# EAGLE design LC-meter (EAGLE 7.5.0)
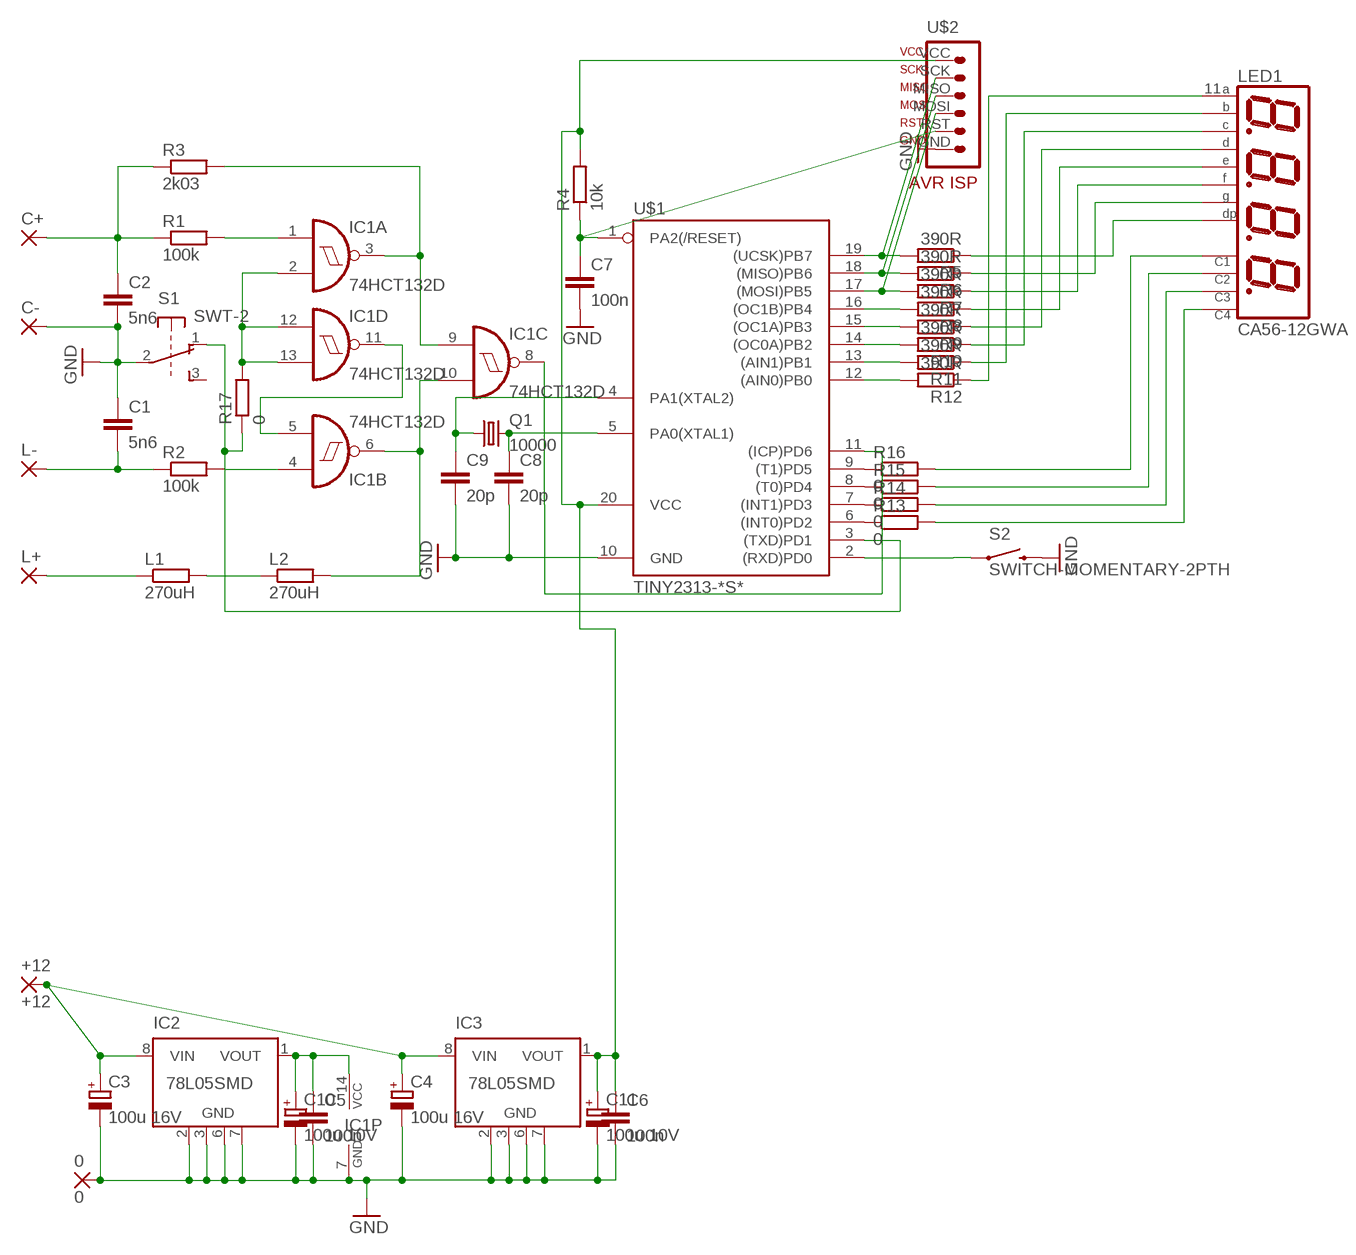
[diagram p0: schematic, sheet 1]

## Parts
0  0  3,17/1,1  [3,17/1,1]
+12  +12  3,17/1,1  [3,17/1,1]
C1  5n6  C-EUC0805  [C0805]
C2  5n6  C-EUC0805  [C0805]
C3  100u 16V  CPOL-EUE2.5-7  [E2,5-7]
C4  100u 16V  CPOL-EUE2.5-7  [E2,5-7]
C5  100n  C-EUC0805  [C0805]
C6  100n  C-EUC0805  [C0805]
C7  100n  C-EUC0805  [C0805]
C8  20p  C-EUC1206  [C1206]
C9  20p  C-EUC1206  [C1206]
C10  100u 10V  CPOL-EUE2.5-7  [E2,5-7]
C11  100u 10V  CPOL-EUE2.5-7  [E2,5-7]
C+  3,17/1,1  [3,17/1,1]
C-  3,17/1,1  [3,17/1,1]
IC1  74HCT132D  [SO14]
IC2  78L05SMD  [SO08]
IC3  78L05SMD  [SO08]
L1  270uH  R-EU_R1210  [R1210]
L2  270uH  R-EU_R1210  [R1210]
L+  3,17/1,1  [3,17/1,1]
L-  3,17/1,1  [3,17/1,1]
LED1  CA56-12GWA  [0,56_4X7SEG_LED]
Q1  10000  CRYSTALHC49S  [HC49/S]
R1  100k  R-EU_R1206  [R1206]
R2  100k  R-EU_R1206  [R1206]
R3  2k03  R-EU_R1206  [R1206]
R4  10k  R-EU_R1206  [R1206]
R5  390R  R-EU_R1206  [R1206]
R6  390R  R-EU_R1206  [R1206]
R7  390R  R-EU_R1206  [R1206]
R8  390R  R-EU_R1206  [R1206]
R9  390R  R-EU_R1206  [R1206]
R10  390R  R-EU_R1206  [R1206]
R11  390R  R-EU_R1206  [R1206]
R12  390R  R-EU_R1206  [R1206]
R13  0  R-EU_R1206  [R1206]
R14  0  R-EU_R1206  [R1206]
R15  0  R-EU_R1206  [R1206]
R16  0  R-EU_R1206  [R1206]
R17  0  R-EU_R1206  [R1206]
S1  SWT-2  [SWT-2]
S2  SWITCH-MOMENTARY-2PTH  [TACTILE-PTH]
U$1  TINY2313-*S*  [SO20L$]
U$2  AVR-ISP-6-ROW  [AVR-ISP-6-ROW]

## Nets
GND: 0.1(P) C1.1 C2.2 C3.- C4.- C5.2 C6.2 C7.2 C8.2 C9.2 C10.- C11.- C-.1(P) IC1.7(P:GND) IC2.2(GND) IC2.3(GND) IC2.6(GND) IC2.7(GND) IC3.2(GND) IC3.3(GND) IC3.6(GND) IC3.7(GND) S1.2 S2.3 U$1.10(GND) U$2.GND
N$1: IC1.8(C:O) U$1.11((ICP)PD6)
N$2: R17.1 S1.1 U$1.3((TXD)PD1)
N$3: IC1.5(B:I1) IC1.11(D:O)
N$4: IC1.6(B:O) IC1.10(C:I1) L2.2
N$5: IC1.3(A:O) IC1.9(C:I0) R3.2
N$6: IC1.1(A:I0) R1.2
N$7: IC1.4(B:I0) R2.2
N$8: C1.2 L-.1(P) R2.1
N$9: C2.1 C+.1(P) R1.1 R3.1
N$10: L1.1 L+.1(P)
N$11: L1.2 L2.1
N$12: +12.1(P) C3.+ C4.+ IC2.8(VIN) IC3.8(VIN)
N$13: R5.2 U$1.19((UCSK)PB7) U$2.SCK
N$14: R13.1 U$1.6((INT0)PD2)
N$15: C6.1 C11.+ IC3.1(VOUT) R4.2 U$1.20(VCC) U$2.VCC
N$16: C5.1 C10.+ IC1.14(P:VCC) IC2.1(VOUT)
N$17: R6.2 U$1.18((MISO)PB6) U$2.MISO
N$18: C7.1 R4.1 U$1.1(PA2(/RESET)) U$2.RST
N$19: C8.1 Q1.2 U$1.5(PA0(XTAL1))
N$20: C9.1 Q1.1 U$1.4(PA1(XTAL2))
N$21: S2.1 U$1.2((RXD)PD0)
N$22: R7.2 U$1.17((MOSI)PB5) U$2.MOSI
N$23: R8.2 U$1.16((OC1B)PB4)
N$24: R9.2 U$1.15((OC1A)PB3)
N$25: R10.2 U$1.14((OC0A)PB2)
N$26: R11.2 U$1.13((AIN1)PB1)
N$27: R12.2 U$1.12((AIN0)PB0)
N$28: LED1.11(A) R12.1
N$29: LED1.7(B) R11.1
N$30: LED1.4(C) R10.1
N$31: LED1.2(D) R9.1
N$32: LED1.1(E) R8.1
N$33: LED1.10(F) R7.1
N$34: LED1.5(G) R6.1
N$35: LED1.3(DP) R5.1
N$36: LED1.12(A1) R16.2
N$37: LED1.9(A2) R15.2
N$38: LED1.8(A3) R14.2
N$39: LED1.6(A4) R13.2
N$40: R14.1 U$1.7((INT1)PD3)
N$41: R15.1 U$1.8((T0)PD4)
N$42: R16.1 U$1.9((T1)PD5)
N$43: IC1.2(A:I1) IC1.12(D:I0) IC1.13(D:I1) R17.2
Unconnected: IC2.4(NC) IC2.5(NC) IC3.4(NC) IC3.5(NC) S1.3 S1.4 S1.5 S1.6

## Library data of the parts
0 +12 C+ C- L+ L- = wirepad:3,17/1,1: THROUGH-HOLE PAD
C1 C2 C5-C9 = rcl:C-EU: CAPACITOR, European symbol
C3 C4 C10 C11 = rcl:CPOL-EU: POLARIZED CAPACITOR, European symbol
IC1 = 74xx-eu:74*132: Quad 2-input NAND schmitt trigger
IC2 IC3 = linear:78L*SMD: Positive VOLTAGE REGULATOR
L1 L2 R1-R17 = rcl:R-EU_: RESISTOR, European symbol
LED1 = Namenlos:CA56-12GWA
Q1 = crystal:CRYSTAL: CRYSTAL; OC_FARNELL: 1667008; OC_NEWARK: unknown
S1 = Namenlos:SWT-2
S2 = SparkFun-Electromechanical:SWITCH-MOMENTARY-2: Various NO switches- pushbuttons, reed, etc; PROD_ID: SWCH-08441
U$1 = avr-7:TINY2313*: Atmel Tiny2313 2K Flash, 128 bytes EEPROM, 128 bytes RAM
U$2 = Namenlos:AVR-ISP-6-ROW

## Board
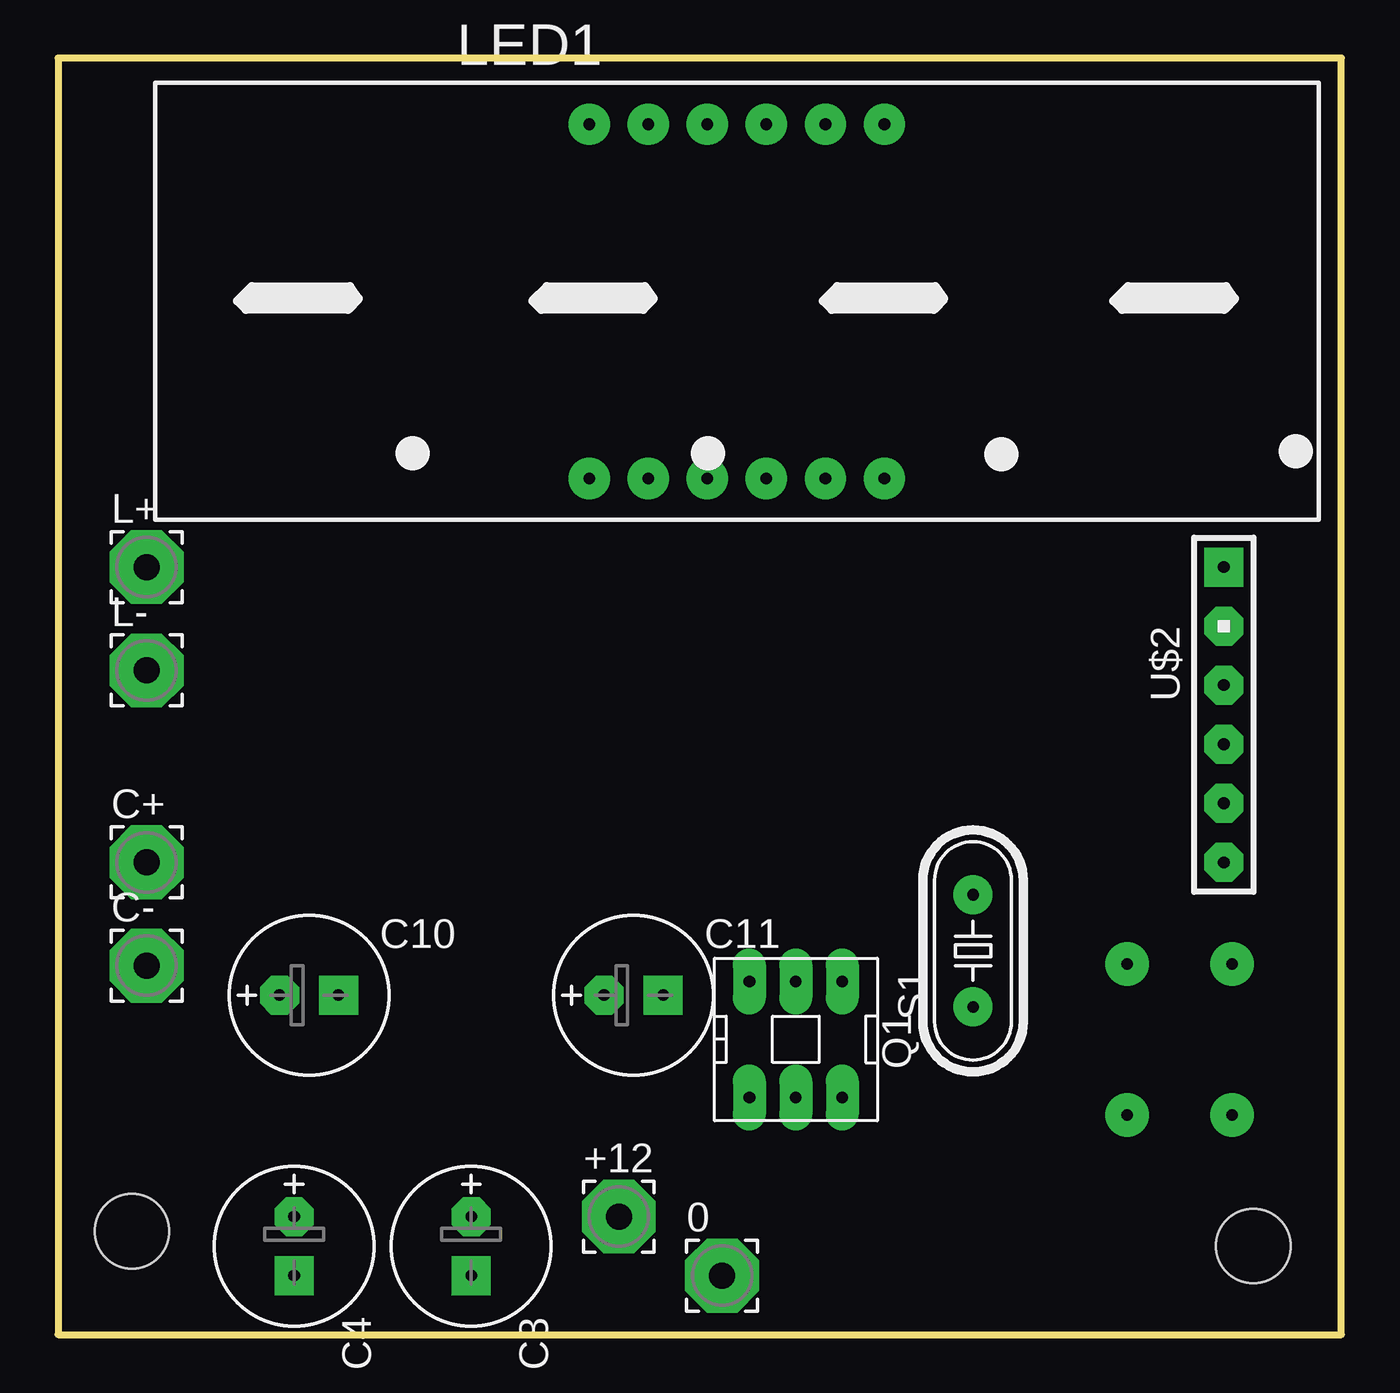
[diagram p1: board, top side]
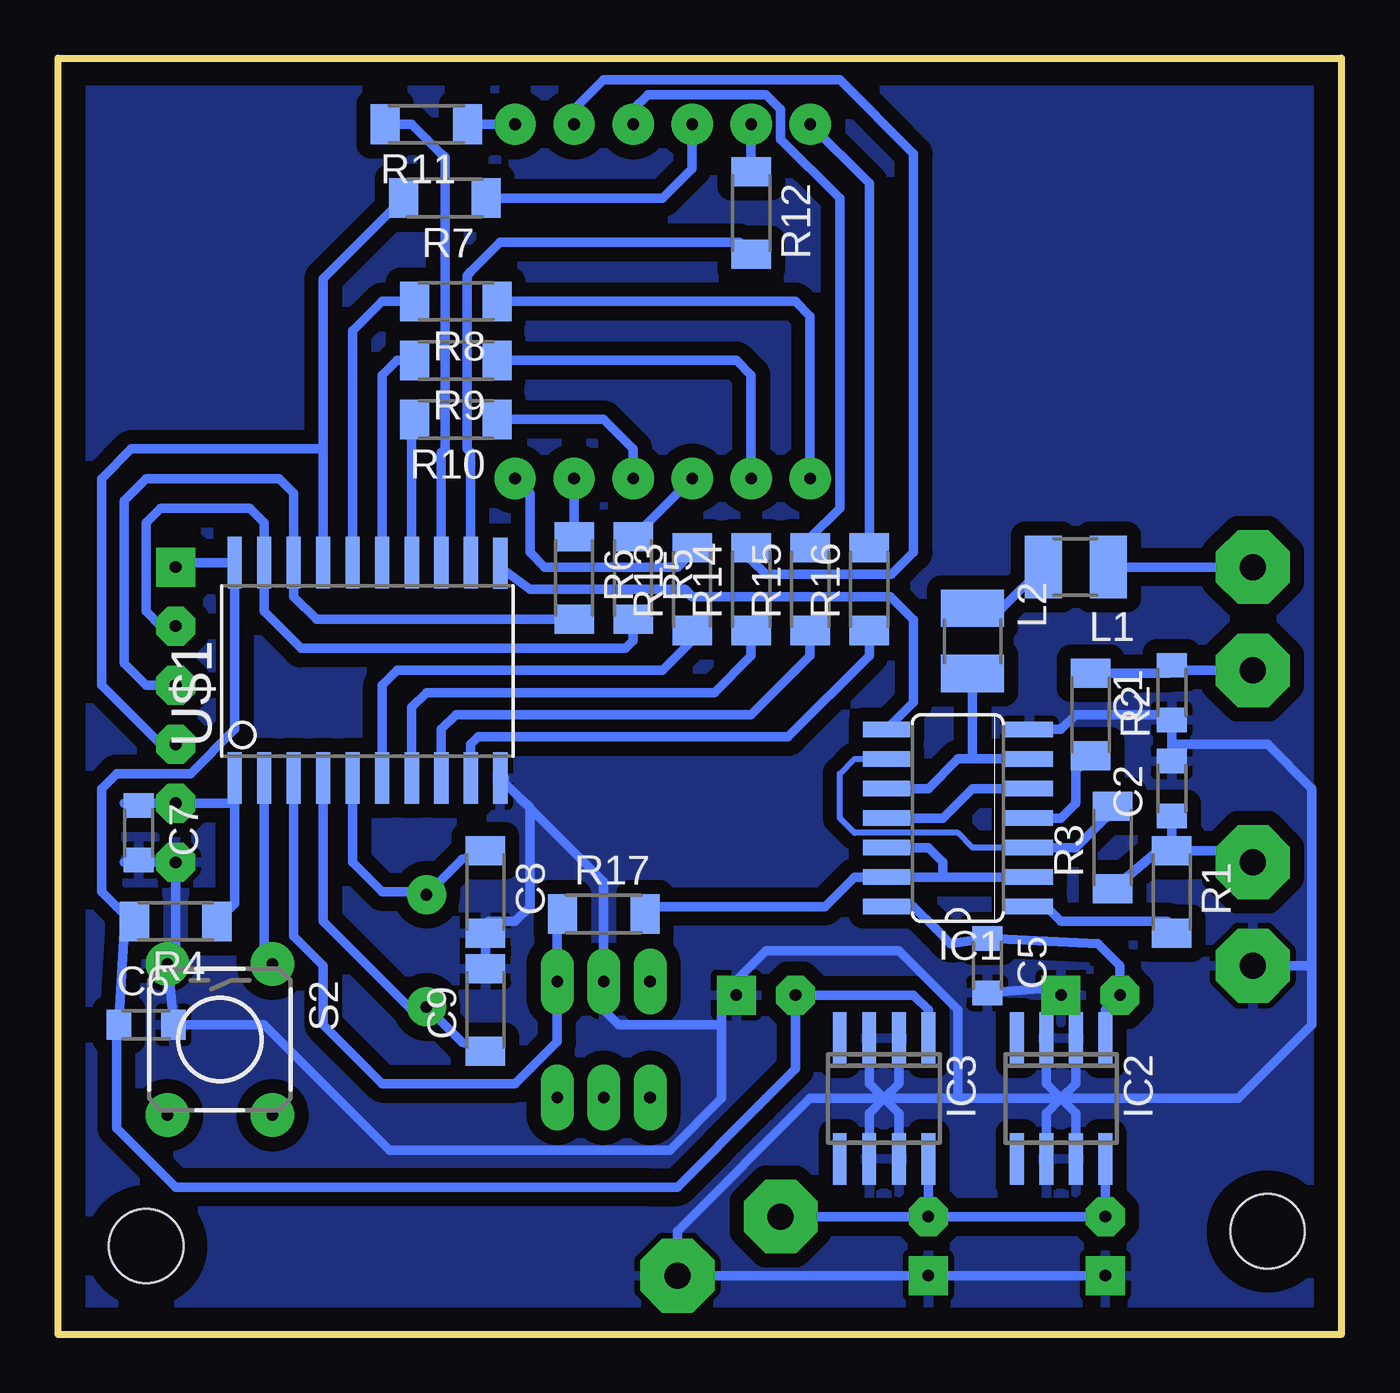
[diagram p2: board, bottom side, seen from below]

Size 55.23 x 54.91 mm. Coordinates in mm from the lower left corner, seen from the top.
Outline: 0,0 55.23,0 55.23,54.91 0,54.91 0,0
Copper layers (1*16): Top 0.035mm / dielectric 1.5mm / Bottom 0.035mm
Design rules "default": minimum track width 10mil, minimum drill 24mil, track to track 8mil, track to pad 8mil, pad to pad 8mil, via to via 8mil, smd to smd 8mil, copper to edge 40mil, drill to drill 8mil, minimum pad ring 10mil, minimum via ring 8mil, stop-mask expansion 4mil, vias tented up to drill 0mil, thermal gap 10mil
Holes 3.2 mm at 3.17,4.45 51.43,3.81

### Footprints (pad centres in the part's own frame; a part is rotated, then mirrored left to right if it is on the bottom)
3,17/1,1 = drill 1.118 pad 3.175 octagon: 1 0,0
C0805 = smd 1.05 x 1.3: 1 -1.175,0; 2 1.175,0
E2,5-7 = drill 0.5 pad 1.676 octagon: + -1.27,0 | drill 0.5 pad 1.676 square: - 1.27,0
C1206 = smd 1.25 x 1.7: 1 -1.775,0; 2 1.775,0
SO14 = smd 0.66 x 2.032: 1 -3.81,-3.073; 2 -2.54,-3.073; 3 -1.27,-3.073; 4 0,-3.073; 5 1.27,-3.073; 6 2.54,-3.073; 7 3.81,-3.073; 8 3.81,3.073; 9 2.54,3.073; 10 1.27,3.073; 11 0,3.073; 12 -1.27,3.073; 13 -2.54,3.073; 14 -3.81,3.073
SO08 = smd 0.6 x 2.2: 1 -1.905,-2.6; 2 -0.635,-2.6; 3 0.635,-2.6; 4 1.905,-2.6; 5 1.905,2.6; 6 0.635,2.6; 7 -0.635,2.6; 8 -1.905,2.6
R1210 = smd 1.6 x 2.7: 1 -1.4,0; 2 1.4,0
0,56_4X7SEG_LED = drill 0.5 pad 1.778: 1 -6.35,-7.62; 2 -3.81,-7.62; 3 -1.27,-7.62; 4 1.27,-7.62; 5 3.81,-7.62; 6 6.35,-7.62; 7 6.35,7.62; 8 3.81,7.62; 9 1.27,7.62; 10 -1.27,7.62; 11 -3.81,7.62; 12 -6.35,7.62
HC49/S = drill 0.5 pad 1.676: 1 -2.413,0; 2 2.413,0
R1206 = smd 1.25 x 1.7: 1 -1.775,0; 2 1.775,0
SWT-2 = drill 0.5 pad 1.422 long: 1 -2.497,2; 2 -2.497,0; 3 -2.497,-2; 4 2.503,2; 5 2.503,0; 6 2.503,-2
TACTILE-PTH = drill 0.5 pad 1.88: 1 -3.251,2.261; 2 3.251,2.261; 3 -3.251,-2.261; 4 3.251,-2.261
SO20L$ = smd 0.61 x 2.21: 1 -5.715,-4.636; 2 -4.445,-4.636; 3 -3.175,-4.636; 4 -1.905,-4.636; 5 -0.635,-4.636; 6 0.635,-4.636; 7 1.905,-4.636; 8 3.175,-4.636; 9 4.445,-4.636; 10 5.715,-4.636; 11 5.715,4.61; 12 4.445,4.636; 13 3.175,4.636; 14 1.905,4.636; 15 0.635,4.636; 16 -0.635,4.636; 17 -1.905,4.636; 18 -3.175,4.636; 19 -4.445,4.636; 20 -5.715,4.636
AVR-ISP-6-ROW = drill 0.5 pad 1.676 octagon: GND 6.35,0; MISO -1.27,0; MOSI 1.27,0; RST 3.81,0; SCK -3.81,0 | drill 0.5 pad 1.676 square: VCC -6.35,0

### Placement (x,y rotation side)
0  28.58,2.54 0 top
+12  24.13,5.08 0 top
C1  7.3,27.62 90 bottom
C2  7.3,23.49 90 bottom
C3  17.78,3.81 270 top
C4  10.16,3.81 270 top
C5  15.24,15.87 270 bottom
C6  51.43,13.34 0 bottom
C7  51.75,21.59 270 bottom
C8  36.83,19.05 270 bottom
C9  36.83,13.97 90 bottom
C10  10.8,14.6 0 top
C11  24.77,14.6 0 top
C+  3.81,20.32 0 top
C-  3.81,15.87 0 top
IC1  16.51,22.23 90 bottom
IC2  12.06,10.16 180 bottom
IC3  19.69,10.16 180 bottom
L1  11.43,33.02 180 bottom
L2  15.88,29.84 270 bottom
L+  3.81,33.02 0 top
L-  3.81,28.57 0 top
LED1  29.21,44.45 0 top
Q1  39.37,16.51 90 top
R1  7.3,19.05 270 bottom
R2  10.8,26.67 270 bottom
R3  9.84,20.96 90 bottom
R4  50.17,17.78 180 bottom
R5  30.48,32.54 270 bottom
R6  33.02,32.54 270 bottom
R7  38.58,48.9 180 bottom
R8  38.1,44.45 180 bottom
R9  38.1,41.91 180 bottom
R10  38.1,39.37 180 bottom
R11  39.37,52.07 180 bottom
R12  25.4,48.26 270 bottom
R13  27.94,32.07 90 bottom
R14  25.4,32.07 90 bottom
R15  22.86,32.07 90 bottom
R16  20.32,32.07 90 bottom
R17  31.75,18.1 0 bottom
S1  31.75,12.7 270 top
S2  48.26,12.7 270 bottom
U$1  41.91,28.57 0 bottom
U$2  50.17,26.67 270 top

### Tracks (layer width: path | path; a pad name or v marks a point on that pad's centre or on a via)
GND
  Bottom 0.406: C7.2 52.39,20.32 U$2.GND 50.17,16.31 S2.3 | S2.3 50.24,15.95 | 36,23.94 U$1.10 35.34,23.08 | 26.67,13.34 31.11,13.34 31.75,13.97 S1.2 31.75,17.78 31.75,19.49 35.34,23.08 | C9.2 36.83,16.51 C8.2 36.7,17.78 35.56,17.78 34.92,18.41 34.92,22.67 35.34,23.08 | 26.67,13.34 26.67,10.16 28.89,7.94 40.96,7.94 46.35,13.34 C6.2 50.48,15.92 S2.3 | 26.67,13.34 26.67,13.97 C11.- 26.03,15.24 24.77,16.51 19.05,16.51 16.51,13.97 16.51,10.16 | IC3.2 19.05,10.79 19.69,10.16 | IC3.3 20.32,10.79 19.69,10.16 | IC3.6 20.32,9.52 19.69,10.16 | 19.69,10.16 17.14,10.16 16.51,10.16 | IC3.7 19.05,9.52 19.69,10.16 | 12.06,10.16 11.43,10.79 IC2.2 11.43,13.97 C10.- 12.38,14.93 C5.2 15.55,14.93 | 12.06,10.16 12.7,10.79 IC2.3 | IC2.6 12.7,9.52 12.06,10.16 | IC2.7 11.43,9.52 12.06,10.16 | C4.- C3.- 23.49,2.54 0.1 28.58,4.45 22.86,10.16 19.69,10.16 | IC1.7 12.06,26.04 11.43,26.67 7.3,26.67 C1.1 7.3,25.4 | C2.2 7.3,25.4 | C-.1 2.54,15.87 1.27,15.87 | 7.3,25.4 3.17,25.4 1.27,23.49 1.27,17.15 1.27,15.87 | 1.27,15.87 1.27,13.34 4.44,10.16 12.06,10.16 | 16.51,10.16 12.06,10.16
  pour Bottom (isolate 0.61): 0,55.24 54.24,55.24 55.24,54.24 55.24,0 1,0 0,1
N$1
  Bottom 0.406: U$1.11 36.19,33.02 34.92,32.07 28.26,32.07 27.94,31.75 19.41,31.75 18.41,30.75 18.41,27.2 IC1.8
N$2
  Bottom 0.406: U$1.3 45.08,17.15 43.81,15.87 43.81,13.34 41.27,10.79 35.56,10.79 34.92,11.43 33.75,12.6 S1.1 33.75,17.87 R17.1
N$3
  Bottom 0.406: IC1.11 17.14,22.23 15.88,23.49 IC1.5
N$4
  Bottom 0.406: IC1.10 17.78,23.49 16.51,24.76 15.88,24.76 | 15.88,24.76 IC1.6 | L2.2 15.88,24.76
N$5
  Bottom 0.254: IC1.3 15.88,20.96 16.51,21.59 20.95,21.59 21.59,22.23 21.59,24.13 20.95,24.76 IC1.9
  Bottom 0.406: IC1.3 11.43,20.96 10.16,22.23 R3.2
N$6
  Bottom 0.406: IC1.1 12.7,18.41 12.06,17.78 7.49,17.78 R1.2
N$7
  Bottom 0.406: IC1.4 12.06,22.23 11.43,22.86 11.43,24.26 R2.2
N$8
  Bottom 0.406: R2.1 7.43,28.45 C1.2 7.3,28.57 L-.1
N$9
  Bottom 0.406: R1.1 7.88,20.82 R3.1 | R1.1 C2.1 | R1.1 4.31,20.82 C+.1
N$10
  Bottom 0.406: L+.1 L1.1
N$11
  Bottom 0.406: L2.1 14.6,31.24 L1.2
N$12
  Bottom 0.406: +12.1 C3.+ | C3.+ C4.+ IC2.8 | IC3.8 C3.+
N$13
  Bottom 0.406: R5.2 30.48,29.84 30.8,29.53 44.77,29.53 46.35,31.12 | 46.35,31.12 46.35,31.75 | 46.35,31.75 46.35,31.12 | 46.35,31.12 46.35,31.75 | 46.35,31.75 U$1.19 46.35,34.93 46.99,35.56 50.8,35.56 51.43,34.93 51.43,31.12 50.8,30.48 U$2.SCK
N$14
  Bottom 0.406: U$1.6 41.27,27.94 40.64,28.57 29.21,28.57 27.94,29.84 R13.1
N$15
  Bottom 0.406: U$2.VCC 49.97,33.21 U$1.20 47.62,26.04 49.53,24.13 52.7,24.13 53.34,23.49 53.34,19.05 52.7,18.41 52.07,17.78 R4.2 52.39,17.34 C6.1 52.7,13.01 52.7,8.89 50.17,6.35 29.84,6.35 28.58,6.35 25.08,9.84 | 25.08,9.84 24.77,10.16 | 25.08,9.84 23.49,11.43 C11.+ 18.41,14.6 17.78,13.97 IC3.1
N$16
  Bottom 0.406: IC1.14 18.41,18.41 17.46,17.46 16.83,16.82 C5.1 10.47,16.82 9.52,15.87 C10.+ 10.16,13.97 IC2.1
N$17
  Bottom 0.406: R6.2 44.1,30.77 45.08,31.75 U$1.18 45.08,36.2 45.72,36.83 51.43,36.83 52.39,35.88 52.39,28.89 51.43,27.94 U$2.MISO
N$18
  Bottom 0.406: C7.1 52.39,22.86 U$2.RST 47.62,22.86 | 47.62,22.86 U$1.1 | U$1.1 47.62,24.13 U$1.1 | R4.1 47.62,18.54 47.62,22.86
N$19
  Bottom 0.406: C8.1 37.84,20.45 Q1.2 39.5,19.05 41.27,19.05 42.55,20.32 U$1.5
N$20
  Bottom 0.406: C9.1 37.84,12.57 Q1.1 39.5,13.97 40,13.97 43.81,17.78 U$1.4
N$21
  Bottom 0.406: S2.1 46.35,16.31 U$1.2
N$22
  Bottom 0.406: R7.2 43.81,45.43 43.81,38.1 | 43.81,38.1 U$1.17 | U$2.MOSI 50.8,25.4 53.34,27.94 53.34,36.83 52.07,38.1 43.81,38.1
N$23
  Bottom 0.406: U$1.16 42.55,43.18 41.27,44.45 R8.2
N$24
  Bottom 0.406: U$1.15 41.27,41.27 40.64,41.91 R9.2
N$25
  Bottom 0.406: U$1.14 40,39.24 R10.2
N$26
  Bottom 0.406: R11.2 40,52.07 39.37,51.43 38.73,50.8 38.58,50.64 38.58,38.1 38.73,37.94 U$1.13
N$27
  Bottom 0.406: 25.53,46.35 R12.2 25.91,46.99 36.19,46.99 37.46,45.72 37.62,45.56 37.62,38.1 37.46,37.94 U$1.12
N$28
  Bottom 0.406: R12.1 LED1.11
N$29
  Bottom 0.406: R11.1 LED1.7
N$30
  Bottom 0.406: R10.1 31.75,39.37 30.48,38.1 LED1.4
N$31
  Bottom 0.406: R9.1 26.03,41.91 25.4,41.27 LED1.2
N$32
  Bottom 0.406: R8.1 23.49,44.45 22.86,43.82 LED1.1
N$33
  Bottom 0.406: LED1.10 27.94,50.16 29.21,48.9 R7.1
N$34
  Bottom 0.406: R6.1 LED1.5
N$35
  Bottom 0.406: R5.1 30.48,34.29 28.58,36.2 LED1.3
N$36
  Bottom 0.406: R16.2 20.32,49.53 LED1.12
N$37
  Bottom 0.406: R15.2 22.86,34.29 21.59,35.56 21.59,48.9 24.13,51.43 24.13,52.71 24.77,53.34 29.84,53.34 30.48,52.71 LED1.9
N$38
  Bottom 0.406: R14.2 25.4,33.34 24.77,32.7 19.37,32.7 18.41,33.65 18.41,50.8 21.59,53.98 31.75,53.98 33.02,52.71 LED1.8
N$39
  Bottom 0.406: R13.2 27.94,33.65 28.58,33.02 34.29,33.02 34.92,33.65 34.92,36.2 LED1.6
N$40
  Bottom 0.406: U$1.7 40,26.99 39.37,27.62 26.99,27.62 25.4,29.21 R14.1
N$41
  Bottom 0.406: U$1.8 38.73,26.04 38.1,26.67 25.4,26.67 23.49,28.57 22.86,29.21 R15.1
N$42
  Bottom 0.406: U$1.9 37.46,25.4 37.15,25.72 25.08,25.72 23.81,25.72 20.32,29.21 R16.1
N$43
  Bottom 0.406: 29.53,18.1 R17.2 29.66,18.41 22.22,18.41 20.95,19.68 IC1.13 17.14,19.68 | 17.14,19.68 IC1.2 | IC1.12 17.78,20.96 17.14,20.32 17.14,19.68